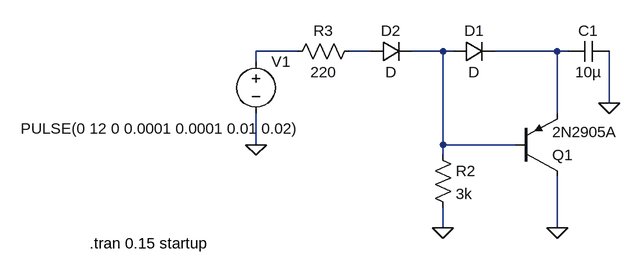
[diagram p0: schematic CapDischarge_PNP.asc]
CapDischarge_PNP.asc, the LTspice schematic file:
Version 4
SHEET 1 880 680
WIRE 0 64 -64 64
WIRE 112 64 80 64
WIRE 224 64 176 64
WIRE 240 64 224 64
WIRE 400 64 304 64
WIRE 416 64 400 64
WIRE -64 80 -64 64
WIRE 480 144 480 64
WIRE 400 160 400 64
WIRE -64 208 -64 160
WIRE 224 208 224 64
WIRE 336 208 224 208
WIRE 224 224 224 208
WIRE 224 336 224 304
WIRE 400 336 400 256
FLAG -64 208 0
FLAG 224 336 0
FLAG 400 336 0
FLAG 480 144 0
SYMBOL voltage -64 64 R0
WINDOW 3 -362 119 Left 2
WINDOW 123 0 0 Left 0
WINDOW 39 0 0 Left 0
SYMATTR Value PULSE(0 12 0 0.0001 0.0001 0.01 0.02)
SYMATTR InstName V1
SYMBOL diode 240 80 R270
WINDOW 0 32 32 VTop 2
WINDOW 3 0 32 VBottom 2
SYMATTR InstName D1
SYMBOL res 208 208 R0
SYMATTR InstName R2
SYMATTR Value 3k
SYMBOL pnp 336 256 M180
SYMATTR InstName Q1
SYMATTR Value 2N2905A
SYMBOL cap 480 48 R90
WINDOW 0 0 32 VBottom 2
WINDOW 3 32 32 VTop 2
SYMATTR InstName C1
SYMATTR Value 10µ
SYMBOL res 96 48 R90
WINDOW 0 0 56 VBottom 2
WINDOW 3 32 56 VTop 2
SYMATTR InstName R3
SYMATTR Value 220
SYMBOL diode 112 80 R270
WINDOW 0 32 32 VTop 2
WINDOW 3 0 32 VBottom 2
SYMATTR InstName D2
TEXT -320 360 Left 2 !.tran 0.15 startup

The netlist it stands for:
* CapDischarge_PNP.asc
V1 N001 0 PULSE(0 12 0 0.0001 0.0001 0.01 0.02)
D1 N003 N004 D
R2 N003 0 3k
Q1 0 N003 N004 0 2N2905A
C1 0 N004 10µ
R3 N002 N001 220
D2 N002 N003 D
.model D D
.lib standard.dio
.model NPN NPN
.model PNP PNP
.lib standard.bjt
.tran 0.15 startup
.backanno
.end